# EAGLE design Mainboard Titan (EAGLE 9.4.2)
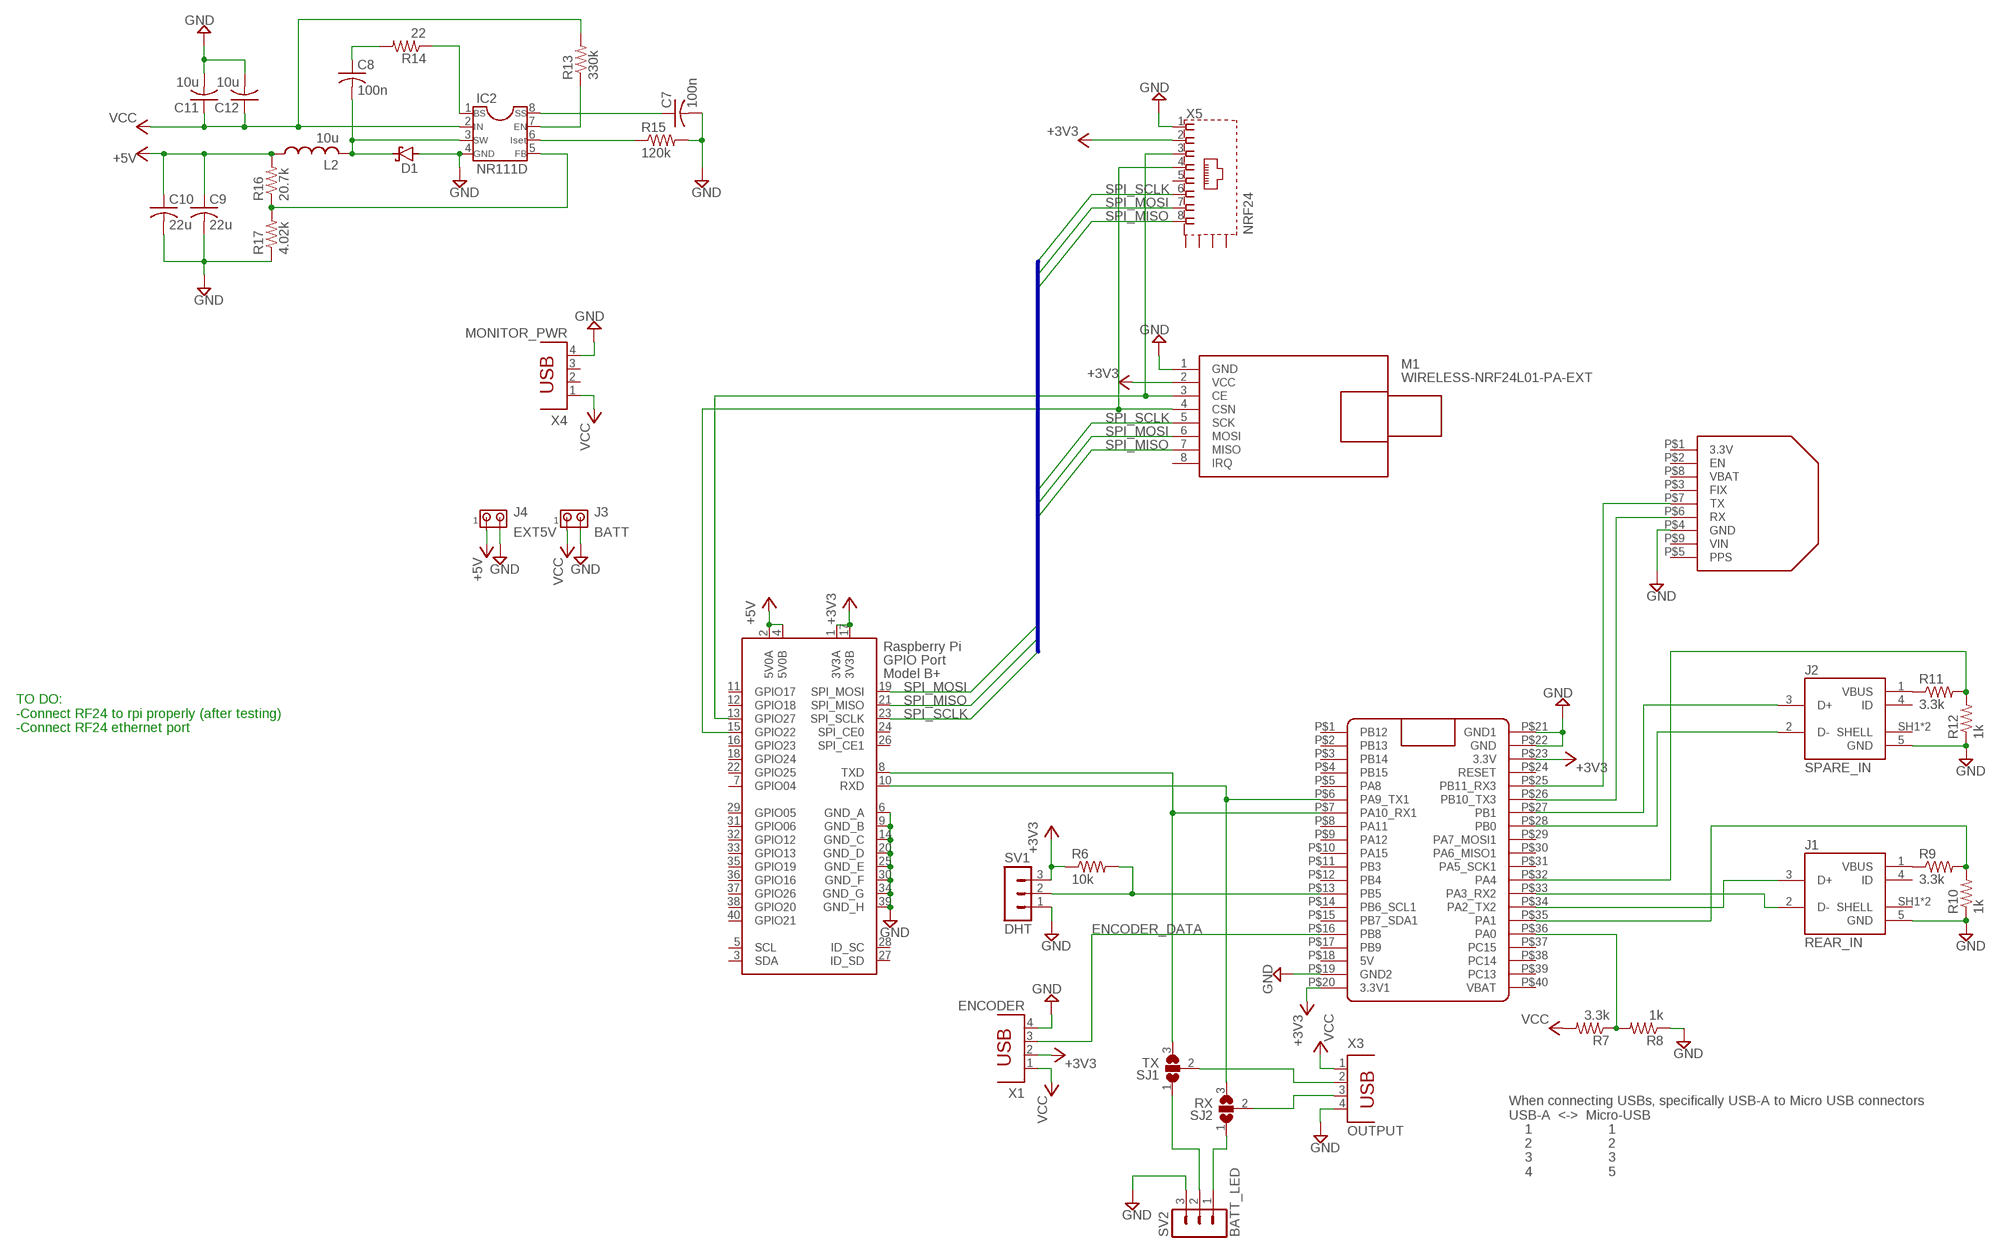
[diagram p0: schematic, sheet 1]

## Parts
C7  100n  C-US050-024X044  [C050-024X044]
C8  100n  C-US050-024X044  [C050-024X044]
C9  22u  C-US025-024X044  [C025-024X044]
C10  22u  C-US025-024X044  [C025-024X044]
C11  10u  C-US025-024X044  [C025-024X044]
C12  10u  C-US025-024X044  [C025-024X044]
D1  SCHOTTKY-DIODEC4111-15  [C4111-15]
IC2  NR111D  DIL8  [DIL08]
J1  REAR_IN  2172034-1  [TE_2172034-1]
J2  SPARE_IN  2172034-1  [TE_2172034-1]
J3  BATT  MTA02-156  [1X2MTA]
J4  EXT5V  MTA02-156  [1X2MTA]
L2  10u  WURTHINDUCTOR1  [INDRD650W105D880H1100B]
M1  WIRELESS-NRF24L01-PA-EXT  [WIRELESS-NRF24L01-PA-EXT]
R6  10k  R-US_0204/7  [0204/7]
R7  3.3k  R-US_0204/7  [0204/7]
R8  1k  R-US_0204/7  [0204/7]
R9  3.3k  R-US_0204/7  [0204/7]
R10  1k  R-US_0204/7  [0204/7]
R11  3.3k  R-US_0204/7  [0204/7]
R12  1k  R-US_0204/7  [0204/7]
R13  330k  R-US_0204/7  [0204/7]
R14  22  R-US_0204/7  [0204/7]
R15  120k  R-US_0204/7  [0204/7]
R16  20.7k  R-US_0204/7  [0204/7]
R17  4.02k  R-US_0204/7  [0204/7]
SJ1  TX  SJ2W  [SJ_2]
SJ2  RX  SJ2W  [SJ_2]
SV1  DHT  MA03-1  [MA03-1]
SV2  BATT_LED  MA03-1  [MA03-1]
U$1  BLUE_PILL  [BLUE_PILL]
U$3  ULTIMATE-GPS  [ULTIMATE_GPS]
X1  ENCODER  PN87520  [PN87520]
X2  RASPI_GPIO_B+#_BOX  [RASPI_GPIO_B+_BOX]
X3  OUTPUT  PN87520  [PN87520]
X4  MONITOR_PWR  PN87520  [PN87520]
X5  NRF24  RJ45-6L21-S  [RJ45-SHIELD1]

## Nets
25%LED: SJ1.1 SV2.2
50%LED: SJ2.1 SV2.1
+3V3: M1.2(VCC) R6.1 SV1.3 U$1.P$20(3.3V1) U$1.P$23(3.3V) X1.2 X2.1(3V3A) X2.17(3V3B) X5.2
+5V: C9.1 C10.1 J4.1 L2.1 R16.2 X2.2(5V0A) X2.4(5V0B)
BATT_LVL: R7.1 R8.2 U$1.P$36(PA0)
DHT: R6.2 SV1.2 U$1.P$13(PB5)
ENCODER_DATA: U$1.P$16(PB8) X1.3
GND: C7.2 C9.2 C10.2 C11.2 C12.2 D1.A IC2.4(GND) J1.5(GND) J2.5(GND) J3.2 J4.2 M1.1(GND) R8.1 R10.1 R12.1 R15.2 R17.1 SV1.1 SV2.3 U$1.P$19(GND2) U$1.P$21(GND1) U$1.P$22(GND) U$3.P$4(GND) X1.4 X2.6(GND_A) X2.9(GND_B) X2.14(GND_C) X2.20(GND_D) X2.25(GND_E) X2.30(GND_F) X2.34(GND_G) X2.39(GND_H) X3.4 X4.4 X5.1
N$1: M1.3(CE) X2.13(GPIO27) X5.3
N$2: M1.4(CSN) X2.15(GPIO22) X5.4
N$3: SJ1.2 X3.2
N$4: U$1.P$26(PB10_TX3) U$3.P$6(RX)
N$5: SJ2.2 X3.3
N$6: U$1.P$25(PB11_RX3) U$3.P$7(TX)
N$9: J1.3(D+) U$1.P$34(PA2_TX2)
N$12: J1.2(D-) U$1.P$33(PA3_RX2)
N$14: IC2.5(FB) R16.1 R17.2
N$15: J1.1(VBUS) R9.1
N$16: R9.2 R10.2 U$1.P$35(PA1)
N$17: J2.1(VBUS) R11.1
N$18: R11.2 R12.2 U$1.P$32(PA4)
N$19: C8.2 D1.C IC2.3(SW) L2.2
N$20: J2.2(D-) U$1.P$28(PB0)
N$21: J2.3(D+) U$1.P$27(PB1)
N$22: C8.1 R14.2
N$23: C7.1 IC2.8(SS)
N$24: IC2.6(ISET) R15.1
N$25: IC2.7(EN) R13.1
N$26: IC2.1(BS) R14.1
RPI_RX: SJ2.3 U$1.P$6(PA9_TX1) X2.10(RXD)
RPI_TX: SJ1.3 U$1.P$7(PA10_RX1) X2.8(TXD)
SPI_MISO: M1.7(MISO) X2.21(SPI_MISO) X5.8
SPI_MOSI: M1.6(MOSI) X2.19(SPI_MOSI) X5.7
SPI_SCLK: M1.5(SCK) X2.23(SPI_SCLK) X5.6
VCC: C11.1 C12.1 IC2.2(IN) J3.1 R7.2 R13.2 X1.1 X3.1 X4.1
Unconnected: J1.4(ID) J2.4(ID) M1.8(IRQ) U$1.P$1(PB12) U$1.P$2(PB13) U$1.P$3(PB14) U$1.P$4(PB15) U$1.P$5(PA8) U$1.P$8(PA11) U$1.P$9(PA12) U$1.P$10(PA15) U$1.P$11(PB3) U$1.P$12(PB4) U$1.P$14(PB6_SCL1) U$1.P$15(PB7_SDA1) U$1.P$17(PB9) U$1.P$18(5V) U$1.P$24(RESET) U$1.P$29(PA7_MOSI1) U$1.P$30(PA6_MISO1) U$1.P$31(PA5_SCK1) U$1.P$37(PC15) U$1.P$38(PC14) U$1.P$39(PC13) U$1.P$40(VBAT) U$3.P$2(EN) U$3.P$3(FIX) U$3.P$5(PPS) U$3.P$8(VBAT) U$3.P$9(VIN) X2.3(SDA) X2.5(SCL) X2.7(GPIO04) X2.11(GPIO17) X2.12(GPIO18) X2.16(GPIO23) X2.18(GPIO24) X2.22(GPIO25) X2.24(SPI_CE0) X2.26(SPI_CE1) X2.27(ID_SD) X2.28(ID_SC) X2.29(GPIO05) X2.31(GPIO06) X2.32(GPIO12) X2.33(GPIO13) X2.35(GPIO19) X2.36(GPIO16) X2.37(GPIO26) X2.38(GPIO20) X2.40(GPIO21) X4.2 X4.3 X5.5 X5.S1(S) X5.S2(S) X5.S3(S) X5.S4(S)

## Buses
SPI_MISO,SPI_MOSI,SPI_SCLK

## Notes on the sheet
- TO DO:
  -Connect RF24 to rpi properly (after testing)
  -Connect RF24 ethernet port
- When connecting USBs, specifically USB-A to Micro USB connectors
  USB-A  <->  Micro-USB
      1                   1
      2                   2
      3                   3
      4                   5

## Power pins joined to a net without a drawn wire
3.3V: U$3.P$1(3.3V)
SHELL: J1.SH1(SHELL) J1.SH2(SHELL) J2.SH1(SHELL) J2.SH2(SHELL)

## Library data of the parts
C7-C12 = rcl:C-US: CAPACITOR, American symbol; SPICEPREFIX: C
D1 = diode:SCHOTTKY-DIODE: Schottky Diode
IC2 = NR111D:DIL8: Dual In Line / Socket
J1 J2 = 2172034-1:2172034-1: CONN RCPT USB MINI B 2.0 PCB R/A; COMMENT: 2172034-1; DESCRIPTION: Conn Mini USB Type B RCP 5 POS 0.8mm Solder RA Thru-Hole 5 Terminal 1 Port Box/Tray; DIGI-KEY_PART_NUMBER: A135698-ND; DIGI-KEY_PURCHASE_URL: https://www.digikey.com/product-detail/en/te-connectivity-amp-connectors/2172034-1/A135698-ND/5592056?utm_source=snapeda&utm_medium=aggregator&utm_campaign=symbol; EU_ROHS_COMPLIANCE: Compliant; MF: TE Connectivity; MP: 2172034-1; PACKAGE: None; TE_PURCHASE_URL: https://www.te.com/usa-en/product-2172034-1.html?te_bu=Cor&te_type=disp&te_campaign=seda_glo_cor-seda-global-disp-prtnr-fy19-seda-model-bom-cta_sma-317_1&elqCampaignId=32493
J3 J4 = con-amp:MTA02-156: AMP connector
L2 = NR111D:WURTHINDUCTOR
M1 = diy-modules:WIRELESS-NRF24L01-PA-EXT: 2.4 GHz Wireless Module based on NRF24L01 chip with preamplifier and external antenna Click here to find device on ebay.com <http://www.ebay.com/sch/nrf24l01+pa+lna+sma>
R6-R17 = rcl:R-US_: RESISTOR, American symbol; SPICEPREFIX: R
SJ1 SJ2 = jumper:SJ2W: SMD solder JUMPER
SV1 SV2 = con-lstb:MA03-1: PIN HEADER; OC_FARNELL: unknown; OC_NEWARK: unknown
U$1 = BluePill:BLUE_PILL
U$3 = diy-modules:ULTIMATE-GPS
X1 X3 X4 = con-berg:PN87520: BERG USB connector; OC_FARNELL: unknown; OC_NEWARK: unknown
X2 = raspberrypi_bastelstube_v13:RASPI_GPIO_B+#: 2x20 header connector, all pins connected
X5 = con-tycoelectronics:RJ45*2: RJ45 Low Profile Shield Type 2 For all RJ45 L, LC, LCT and X Series Models Source: www.tycoelectronics.com .. ENG_DS_1654001_1099_RJ_L_0507.pdf; OC_FARNELL: unknown; OC_NEWARK: unknown

## Board
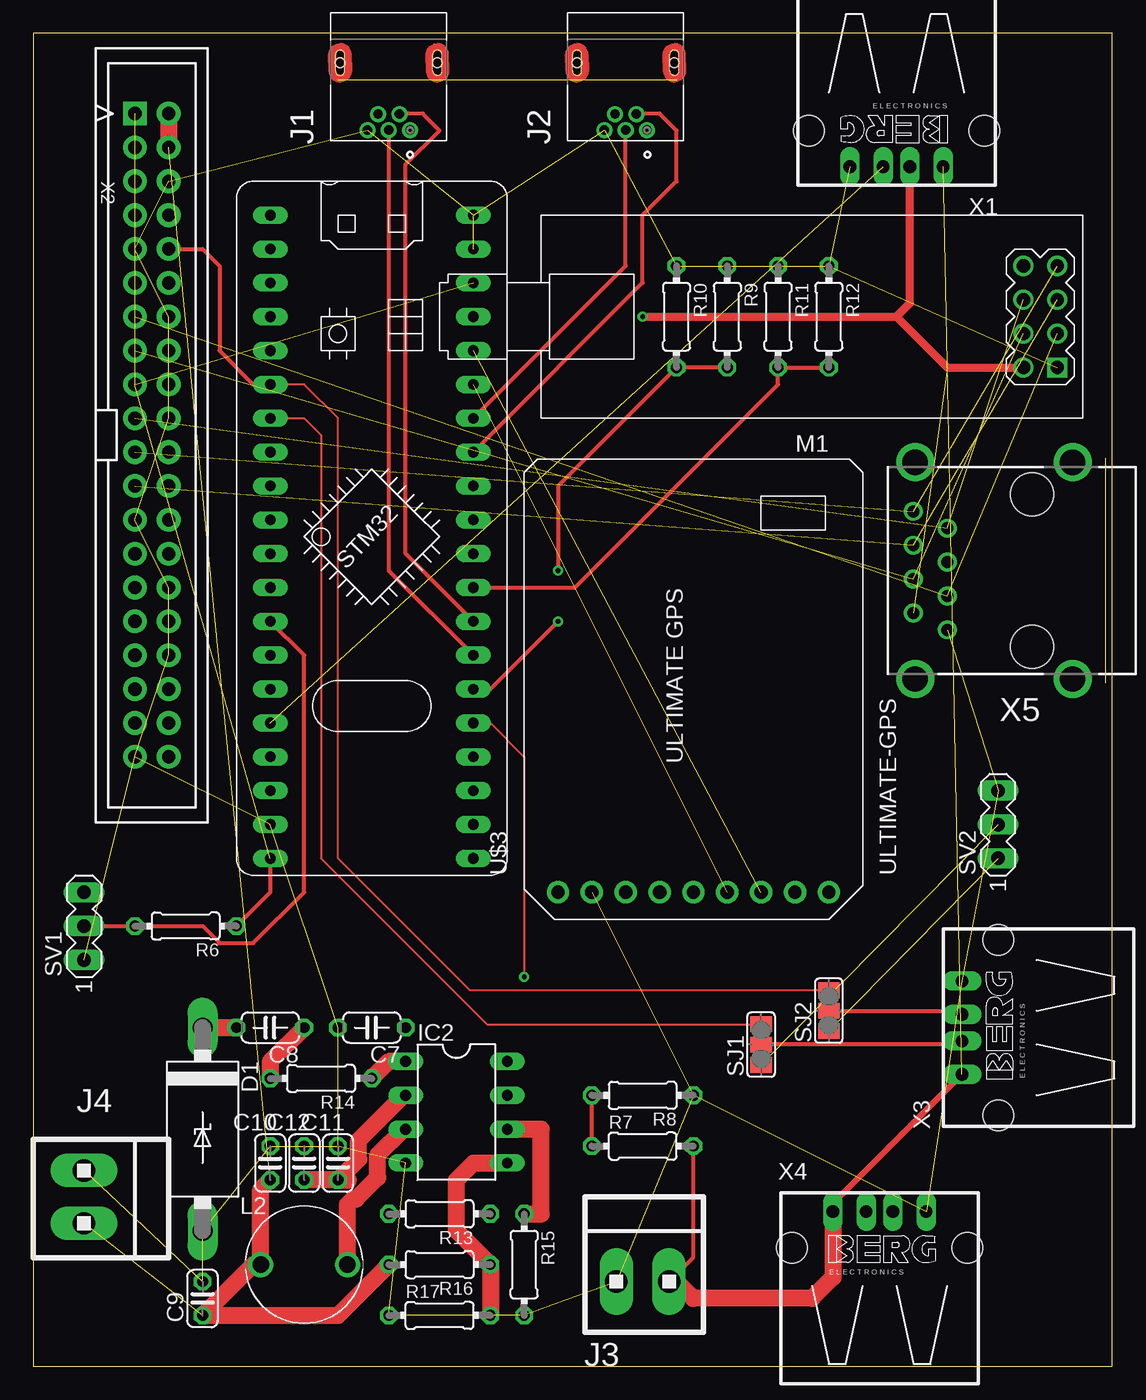
[diagram p1: board, top side]
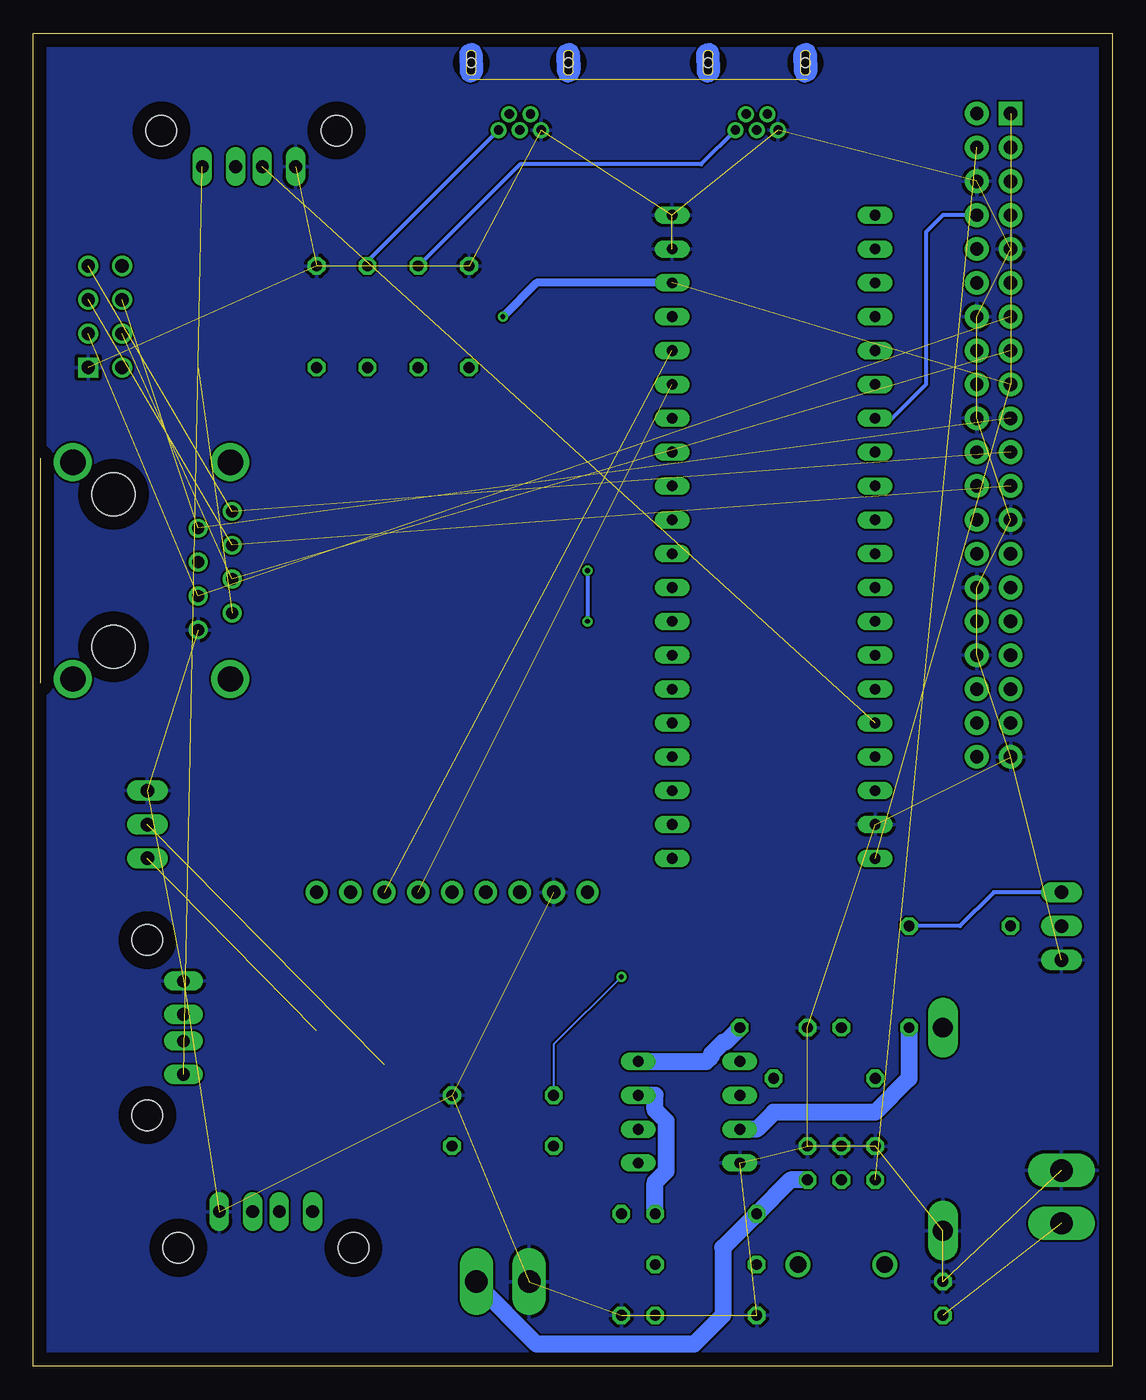
[diagram p2: board, bottom side, seen from below]

Size 80.95 x 100 mm. Coordinates in mm from the lower left corner, seen from the top.
Outline: 0,0 80.95,0 80.95,100 0,100 0,0
Copper layers (1*16): Top 0.035mm / dielectric 1.5mm / Bottom 0.035mm
Design rules "default": minimum track width 6mil, minimum drill 0.35mm, track to track 6mil, track to pad 6mil, pad to pad 6mil, via to via 6mil, smd to smd 6mil, copper to edge 40mil, drill to drill 6mil, minimum pad ring 10mil, minimum via ring 8mil, stop-mask expansion 4mil, vias tented up to drill 0mil, thermal gap 10mil

### Footprints (pad centres in the part's own frame; a part is rotated, then mirrored left to right if it is on the bottom)
C050-024X044 = drill 0.813 octagon: 1 -2.54,0; 2 2.54,0
C025-024X044 = drill 0.813 octagon: 1 -1.27,0; 2 1.27,0
C4111-15 = drill 1.499 long: A 7.62,0; C -7.62,0
DIL08 = drill 0.813 long: 1 -3.81,-3.81; 2 -1.27,-3.81; 3 1.27,-3.81; 4 3.81,-3.81; 5 3.81,3.81; 6 1.27,3.81; 7 -1.27,3.81; 8 -3.81,3.81
TE_2172034-1 = drill 0.7: 1 -5.05,-1.6; 2 -3.85,-0.8; 3 -5.05,0; 4 -3.85,0.8; 5 -5.05,1.6 | smd 0.1 x 0.1: SH1 -1.27,3.81; SH2 -1.27,-3.81 | hole 0.7: 0,3.65; 0,-3.65
1X2MTA = drill 1.676 long: 1 1.981,0; 2 -1.981,0
INDRD650W105D880H1100B = drill 1.25 pad 1.875: 1 -3.25,0; 2 3.25,0
WIRELESS-NRF24L01-PA-EXT = drill 1 square: 1 -18.415,3.81 | drill 1: 2 -15.875,3.81; 3 -18.415,1.27; 4 -15.875,1.27; 5 -18.415,-1.27; 6 -15.875,-1.27; 7 -18.415,-3.81; 8 -15.875,-3.81
0204/7 = drill 0.813 octagon: 1 -3.81,0; 2 3.81,0
SJ_2 = smd 1.168 x 1.6: 1 -1.524,0; 2 0,0; 3 1.524,0
MA03-1 = drill 1.016 long: 1 -2.54,0; 2 0,0; 3 2.54,0
BLUE_PILL = drill 0.8 long: P$1 -7.62,15.24; P$2 -7.62,12.7; P$3 -7.62,10.16; P$4 -7.62,7.62; P$5 -7.62,5.08; P$6 -7.62,2.54; P$7 -7.62,0; P$8 -7.62,-2.54; P$9 -7.62,-5.08; P$10 -7.62,-7.62; P$11 -7.62,-10.16; P$12 -7.62,-12.7; P$13 -7.62,-15.24; P$14 -7.62,-17.78; P$15 -7.62,-20.32; P$16 -7.62,-22.86; P$17 -7.62,-25.4; P$18 -7.62,-27.94; P$19 -7.62,-30.48; P$20 -7.62,-33.02; P$21 7.62,15.24; P$22 7.62,12.7; P$23 7.62,10.16; P$24 7.62,7.62; P$25 7.62,5.08; P$26 7.62,2.54; P$27 7.62,0; P$28 7.62,-2.54; P$29 7.62,-5.08; P$30 7.62,-7.62; P$31 7.62,-10.16; P$32 7.62,-12.7; P$33 7.62,-15.24; P$34 7.62,-17.78; P$35 7.62,-20.32; P$36 7.62,-22.86; P$37 7.62,-25.4; P$38 7.62,-27.94; P$39 7.62,-30.48; P$40 7.62,-33.02
ULTIMATE_GPS = drill 1 pad 1.676: P$1 0,0; P$2 0,2.54; P$3 0,5.08; P$4 0,7.62; P$5 0,10.16; P$6 0,-2.54; P$7 0,-5.08; P$8 0,-7.62; P$9 0,-10.16
PN87520 = drill 0.95 long: 1 -3.5,2.71; 2 -1,2.71; 3 1,2.71; 4 3.5,2.71 | hole 2.3: -6.57,0; 6.57,0
RASPI_GPIO_B+_BOX = drill 1 pad 1.778 square: 1 -24.13,-1.27 | drill 1 pad 1.778: 2 -24.13,1.27; 3 -21.59,-1.27; 4 -21.59,1.27; 5 -19.05,-1.27; 6 -19.05,1.27; 7 -16.51,-1.27; 8 -16.51,1.27; 9 -13.97,-1.27; 10 -13.97,1.27; 11 -11.43,-1.27; 12 -11.43,1.27; 13 -8.89,-1.27; 14 -8.89,1.27; 15 -6.35,-1.27; 16 -6.35,1.27; 17 -3.81,-1.27; 18 -3.81,1.27; 19 -1.27,-1.27; 20 -1.27,1.27; 21 1.27,-1.27; 22 1.27,1.27; 23 3.81,-1.27; 24 3.81,1.27; 25 6.35,-1.27; 26 6.35,1.27; 27 8.89,-1.27; 28 8.89,1.27; 29 11.43,-1.27; 30 11.43,1.27; 31 13.97,-1.27; 32 13.97,1.27; 33 16.51,-1.27; 34 16.51,1.27; 35 19.05,-1.27; 36 19.05,1.27; 37 21.59,-1.27; 38 21.59,1.27; 39 24.13,-1.27; 40 24.13,1.27
RJ45-SHIELD1 = drill 0.9 pad 1.4: 1 -4.445,6.35; 2 -3.175,8.89; 3 -1.905,6.35; 4 -0.635,8.89; 5 0.635,6.35; 6 1.905,8.89; 7 3.175,6.35; 8 4.445,8.89 | drill 1.9 pad 2.5: S1 -8.128,-3.048; S2 8.128,-3.048; S3 -8.128,8.76; S4 8.128,8.76 | hole 3.251: -5.715,0; 5.715,0

### Placement (x,y rotation side)
C7  25.4,25.4 180 top
C8  17.78,25.4 180 top
C9  12.7,5.08 90 top
C10  17.78,15.24 90 top
C11  22.86,15.24 90 top
C12  20.32,15.24 90 top
D1  12.7,17.78 270 top
IC2  31.75,19.05 270 top
J1  26.67,97.79 90 top
J2  44.45,97.79 90 top
J3  45.72,6.35 0 top
J4  3.81,12.7 270 top
L2  20.32,7.62 0 top
M1  58.42,78.74 180 top
R6  11.43,33.02 180 top
R7  45.72,16.51 0 top
R8  45.72,20.32 180 top
R9  52.07,78.74 270 top
R10  48.26,78.74 270 top
R11  55.88,78.74 270 top
R12  59.69,78.74 270 top
R13  30.48,11.43 180 top
R14  21.59,21.59 180 top
R15  36.83,7.62 270 top
R16  30.48,7.62 180 top
R17  30.48,3.81 0 top
SJ1  54.61,24.13 90 top
SJ2  59.69,26.67 90 top
SV1  3.81,33.02 90 top
SV2  72.39,40.64 90 top
U$1  25.4,71.12 0 top
U$3  49.53,35.56 90 top
X1  64.77,92.71 180 top
X2  8.89,69.85 270 top
X3  72.39,25.4 90 top
X4  63.5,8.89 0 top
X5  74.93,59.69 90 top

### Tracks (layer width: path | path; a pad name or v marks a point on that pad's centre or on a via)
25%LED  (1 unrouted)
50%LED  (1 unrouted)
+3V3  (via drill 0.35)  (4 unrouted)
  Top 0.305: U$1.P$20 17.78,35.56 R6.1
  Top 0.61: M1.2 68.58,74.93 64.77,78.74 | v45.72,78.74 64.77,78.74 | 64.77,78.74 65.77,79.74 X1.2
  Bottom 0.305: SV1.3 8.89,35.56 11.43,33.02 R6.1
  Bottom 0.61: U$1.P$23 43.18,81.28 v45.72,78.74
+5V  (2 unrouted)
  Top 1.27: X2.2 X2.4 | R16.2 22.86,3.81 C9.1 16.51,7.62 L2.1 17.07,13.26 C10.1
BATT_LVL  (via drill 0.35)
  Top 0.152: U$1.P$36 34.29,48.26 36.83,45.72 v36.83,29.21
  Top 0.305: R7.1 R8.2
  Bottom 0.152: v36.83,29.21 41.91,24.13 R8.2
DHT
  Top 0.305: SV1.2 R6.2 12.7,33.02 13.97,31.75 16.51,31.75 20.32,35.56 20.32,53.34 U$1.P$13
ENCODER_DATA  (1 unrouted)
GND  (34 unrouted)
  pour Bottom: 0,100.33 0,0 81.28,0 81.28,100.33
N$1  (2 unrouted)
N$2  (2 unrouted)
N$3
  Top 0.305: X3.2 69.41,24.13 SJ1.2
N$4  (1 unrouted)
N$5
  Top 0.305: SJ2.2 69.41,26.67 X3.3
N$6  (1 unrouted)
N$9
  Top 0.305: J1.3 26.67,59.69 U$1.P$34
N$12
  Top 0.305: U$1.P$33 27.94,60.96 27.94,90.17 30.48,92.71 29.21,93.98 27.51,93.98 J1.2
N$14
  Top 1.27: R17.2 R16.1 31.75,10.16 31.75,13.97 33.02,15.24 IC2.5
N$15
  Bottom 0.305: J1.1 30.84,90.17 44.45,90.17 R9.1
N$16  (via drill 0.35)
  Top 0.305: R9.2 R10.2 39.37,66.04 v39.37,59.69 | v39.37,55.88 34.29,50.8 U$1.P$35
  Bottom 0.305: v39.37,59.69 v39.37,55.88
N$17
  Bottom 0.305: J2.1 55.88,82.91 R11.1
N$18
  Top 0.305: R12.2 R11.2 55.88,73.66 40.64,58.42 U$1.P$32
N$19
  Top 1.27: C8.2 D1.C | L2.2 23.57,12.14 23.98,12.55 24.23,12.55 25.83,14.15 25.83,15.84 27.77,17.78 IC2.3
  Bottom 1.27: C8.2 15.24,21.59 17.78,19.05 25.4,19.05 26.67,17.78 IC2.3
N$20
  Top 0.305: U$1.P$28 45.72,81.28 45.72,86.36 48.26,88.9 48.26,92.71 46.99,93.98 45.29,93.98 J2.2
N$21
  Top 0.305: U$1.P$27 44.45,82.55 J2.3
N$22
  Top 1.27: C8.1 17.78,22.86 R14.2
N$23
  Bottom 1.27: IC2.8 30.48,22.86 30.05,23.29 30.05,23.46 29.2,24.31 29.03,24.31 C7.1
N$24
  Top 1.27: R15.1 38.1,11.43 38.1,17.78 IC2.6
N$25
  Bottom 1.27: IC2.7 34.29,20.32 34.29,19.22 33.45,18.38 33.45,14.64 34.29,13.8 R13.1
N$26
  Top 1.27: IC2.1 26.67,22.86 R14.1
RPI_RX
  Top 0.152: SJ2.3 32.77,28.19 22.86,38.1 22.86,71.12 20.32,73.66 U$1.P$6
  Top 0.305: X2.10 12.7,83.82 13.97,82.55 13.97,76.2 16.51,73.66 U$1.P$6
RPI_TX
  Top 0.152: U$1.P$7 20.32,71.12 21.59,69.85 21.59,38.1 34.04,25.65 SJ1.3
  Bottom 0.305: X2.8 12.7,86.36 13.97,85.09 13.97,73.66 16.51,71.12 U$1.P$7
SHELL  (3 unrouted)
SPI_MISO  (2 unrouted)
SPI_MOSI  (2 unrouted)
SPI_SCLK  (2 unrouted)
VCC  (1 unrouted)
  Top 0.305: J3.1 47.98,6.63 49.53,8.18 R7.2
  Top 0.406: X4.1 60,12.22 X3.1
  Top 1.27: X4.1 60,6.66 58.42,5.08 49.53,5.08 47.98,6.63 | IC2.2 27.77,20.32 24.41,16.96 24.41,15.52 C11.1 | C11.1 C12.1 | C11.1 23.64,13.97
  Bottom 1.27: C11.1 24.13,13.97 R13.2 29.21,8.89 29.21,3.81 31.37,1.65 43.19,1.65 47.7,6.16 J3.1